# Altium project ALU_Adder_ZF.PrjPcb
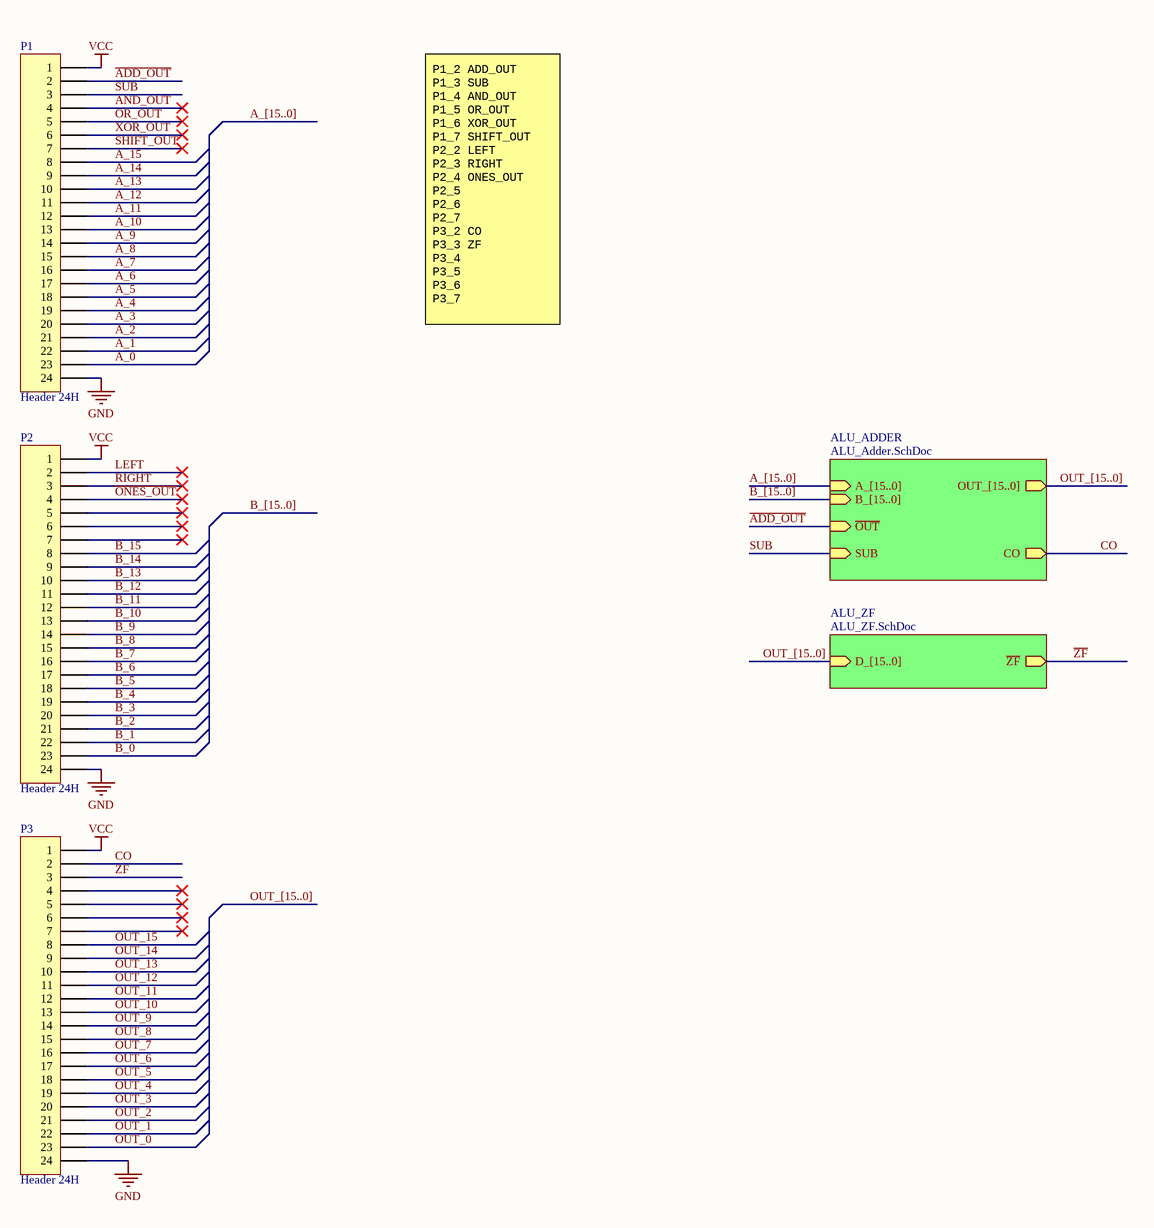
[diagram p0: Connectors.SchDoc]
3 sheets, 12 parts. Net scope: hierarchical (ports join the sheet entries above them; power ports are global).
Board file: ALU_Adder_ZF.PcbDoc
Sheets:
  Connectors.SchDoc
    ALU_ADDER = ALU_Adder.SchDoc
    ALU_ZF = ALU_ZF.SchDoc

## Sheet Connectors.SchDoc
size B; Author: E. Sims; Organization: Let's Build Rockets Inc.; SheetNumber: 1; SheetTotal: 3

### Parts
P1  Header 24H  [HDR1X24H]
P2  Header 24H  [HDR1X24H]
P3  Header 24H  [HDR1X24H]

### Sub-sheets
ALU_ADDER = ALU_Adder.SchDoc: B_[15..0] (in), ~{OUT} (in), OUT_[15..0] (out), SUB (in), A_[15..0] (in), CO (out)
ALU_ZF = ALU_ZF.SchDoc: D_[15..0] (in), ~{ZF} (out)

### Nets
GND: P1.24 P2.24 P3.24
VCC: P1.1 P2.1 P3.1
~{ADD_OUT}: P1.2 ; sheet ALU_ADDER/~{OUT}
~{AND_OUT}: P1.4
A_0: P1.23
A_1: P1.22
A_2: P1.21
A_3: P1.20
A_4: P1.19
A_5: P1.18
A_6: P1.17
A_7: P1.16
A_8: P1.15
A_9: P1.14
A_10: P1.13
A_11: P1.12
A_12: P1.11
A_13: P1.10
A_14: P1.9
A_15: P1.8
B_0: P2.23
B_1: P2.22
B_2: P2.21
B_3: P2.20
B_4: P2.19
B_5: P2.18
B_6: P2.17
B_7: P2.16
B_8: P2.15
B_9: P2.14
B_10: P2.13
B_11: P2.12
B_12: P2.11
B_13: P2.10
B_14: P2.9
B_15: P2.8
CO: P3.2 ; sheet ALU_ADDER/CO
LEFT: P2.2
~{ONES_OUT}: P2.4
~{OR_OUT}: P1.5
OUT_0: P3.23
OUT_1: P3.22
OUT_2: P3.21
OUT_3: P3.20
OUT_4: P3.19
OUT_5: P3.18
OUT_6: P3.17
OUT_7: P3.16
OUT_8: P3.15
OUT_9: P3.14
OUT_10: P3.13
OUT_11: P3.12
OUT_12: P3.11
OUT_13: P3.10
OUT_14: P3.9
OUT_15: P3.8
RIGHT: P2.3
~{SHIFT_OUT}: P1.7
SUB: P1.3 ; sheet ALU_ADDER/SUB
~{XOR_OUT}: P1.6
~{ZF}: P3.3 ; sheet ALU_ZF/~{ZF}

Not connected (* = marked no-connect by the designer): P2 5* 6* 7*; P3 4* 5* 6* 7*

### Buses and harness runs
bus A_[15..0]
bus A_[15..0] = sheet ALU_ADDER/A_[15..0]
bus B_[15..0]
bus B_[15..0] = sheet ALU_ADDER/B_[15..0]
bus OUT_[15..0]
bus OUT_[15..0] = sheet ALU_ADDER/OUT_[15..0]
bus OUT_[15..0] = sheet ALU_ZF/D_[15..0]

### Notes on the sheet
- P1_2 ADD_OUT
  P1_3 SUB
  P1_4 AND_OUT
  P1_5 OR_OUT
  P1_6 XOR_OUT
  P1_7 SHIFT_OUT
  P2_2 LEFT
  P2_3 RIGHT
  P2_4 ONES_OUT
  P2_5
  P2_6
  P2_7
  P3_2 CO
  P3_3 ZF
  P3_4
  P3_5
  P3_6
  P3_7
- Let's Build Rocket's Inc. Modular Paylaod System Based on TMP-010 Rev
  For more information visit https://github.com/LetsBuildRockets/Modular-Payload-System
  This work is licensed under CC BY-NC 4.0. To view a copy of this license, visit https://creativecommons.org/licenses/by-nc/4.0
- Title
- Size:
- Date:
- Assembly Variant:
- B
- Number:
- Time:
- Revision:
- Sheet
- of
- Author:
- File:

### Library data of the parts
P1-P3 = Header 24H: Header, 24-Pin, Right Angle; LatestRevisionDate: 17-Jul-2002; LatestRevisionNote: Re-released for DXP Platform.; Publisher: Altium Limited

## Sheet ALU_Adder.SchDoc
size B; Author: E. Sims; Organization: Let's Build Rockets Inc.; SheetNumber: 18; SheetTotal: 18
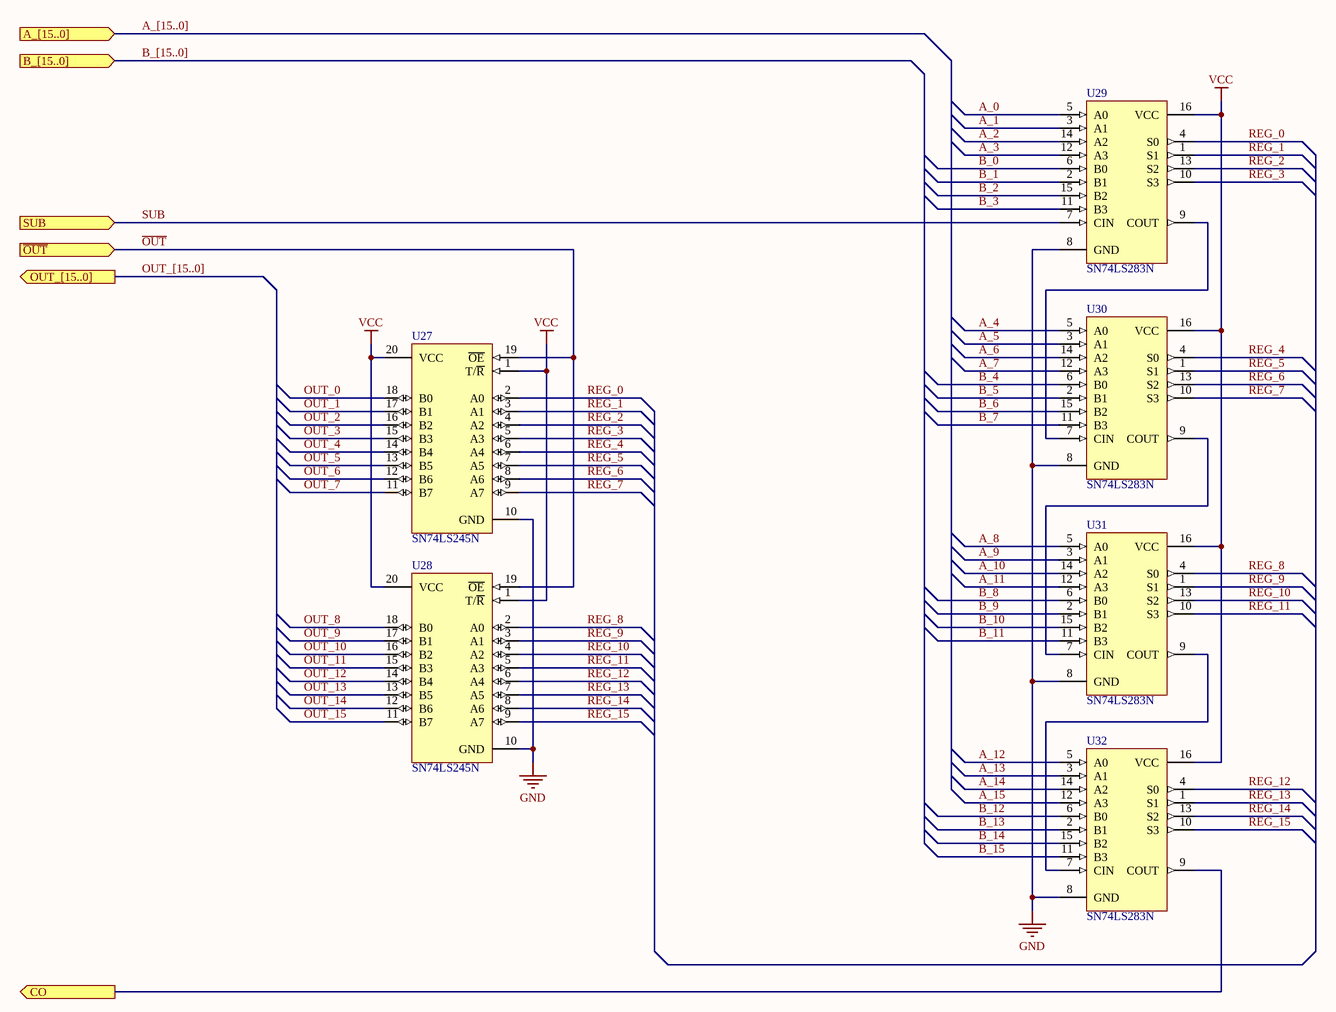
[diagram p1: ALU_Adder.SchDoc]

### Parts
U27  SN74LS245N  [N020]
U28  SN74LS245N  [N020]
U29  SN74LS283N  [W016]
U30  SN74LS283N  [W016]
U31  SN74LS283N  [W016]
U32  SN74LS283N  [W016]

### Ports
A_[15..0] (in), B_[15..0] (in), CO (out), OUT_[15..0] (out), SUB (in), ~{OUT} (in)

### Nets
GND: U27.10(GND) U28.10(GND) U29.8(GND) U30.8(GND) U31.8(GND) U32.8(GND)
VCC: U27.1(T/~{R}) U27.20(VCC) U28.1(T/~{R}) U28.20(VCC) U29.16(VCC) U30.16(VCC) U31.16(VCC) U32.16(VCC)
A_0: U29.5(A0)
A_1: U29.3(A1)
A_2: U29.14(A2)
A_3: U29.12(A3)
A_4: U30.5(A0)
A_5: U30.3(A1)
A_6: U30.14(A2)
A_7: U30.12(A3)
A_8: U31.5(A0)
A_9: U31.3(A1)
A_10: U31.14(A2)
A_11: U31.12(A3)
A_12: U32.5(A0)
A_13: U32.3(A1)
A_14: U32.14(A2)
A_15: U32.12(A3)
B_0: U29.6(B0)
B_1: U29.2(B1)
B_2: U29.15(B2)
B_3: U29.11(B3)
B_4: U30.6(B0)
B_5: U30.2(B1)
B_6: U30.15(B2)
B_7: U30.11(B3)
B_8: U31.6(B0)
B_9: U31.2(B1)
B_10: U31.15(B2)
B_11: U31.11(B3)
B_12: U32.6(B0)
B_13: U32.2(B1)
B_14: U32.15(B2)
B_15: U32.11(B3)
CO: U32.9(COUT) ; port CO
~{OUT}: U27.19(~{OE}) U28.19(~{OE}) ; port ~{OUT}  [project net ~{ADD_OUT}]
OUT_0: U27.18(B0)
OUT_1: U27.17(B1)
OUT_2: U27.16(B2)
OUT_3: U27.15(B3)
OUT_4: U27.14(B4)
OUT_5: U27.13(B5)
OUT_6: U27.12(B6)
OUT_7: U27.11(B7)
OUT_8: U28.18(B0)
OUT_9: U28.17(B1)
OUT_10: U28.16(B2)
OUT_11: U28.15(B3)
OUT_12: U28.14(B4)
OUT_13: U28.13(B5)
OUT_14: U28.12(B6)
OUT_15: U28.11(B7)
REG_0: U27.2(A0) U29.4(S0)
REG_1: U27.3(A1) U29.1(S1)
REG_2: U27.4(A2) U29.13(S2)
REG_3: U27.5(A3) U29.10(S3)
REG_4: U27.6(A4) U30.4(S0)
REG_5: U27.7(A5) U30.1(S1)
REG_6: U27.8(A6) U30.13(S2)
REG_7: U27.9(A7) U30.10(S3)
REG_8: U28.2(A0) U31.4(S0)
REG_9: U28.3(A1) U31.1(S1)
REG_10: U28.4(A2) U31.13(S2)
REG_11: U28.5(A3) U31.10(S3)
REG_12: U28.6(A4) U32.4(S0)
REG_13: U28.7(A5) U32.1(S1)
REG_14: U28.8(A6) U32.13(S2)
REG_15: U28.9(A7) U32.10(S3)
SUB: U29.7(CIN) ; port SUB
NetU29_9: U29.9(COUT) U30.7(CIN)
NetU30_9: U30.9(COUT) U31.7(CIN)
NetU31_9: U31.9(COUT) U32.7(CIN)

### Buses and harness runs
bus A_[15..0] = port A_[15..0]
bus B_[15..0] = port B_[15..0]
bus OUT_[15..0] = port OUT_[15..0]

### Notes on the sheet
- Let's Build Rocket's Inc. Modular Paylaod System Based on TMP-010 Rev
  For more information visit https://github.com/LetsBuildRockets/Modular-Payload-System
  This work is licensed under CC BY-NC 4.0. To view a copy of this license, visit https://creativecommons.org/licenses/by-nc/4.0
- Title
- Size:
- Date:
- Assembly Variant:
- B
- Number:
- Time:
- Revision:
- Sheet
- of
- Author:
- File:

### Library data of the parts
U27 U28 = SN74LS245N: Octal Bus Transceiver with 3-State Outputs; Published: 8-Jun-2000; LatestRevisionDate: 04-Mar-2005; LatestRevisionNote: Stylized 3D Model Added.; DatasheetVersion: Mar-1988; PackageVersion: Oct-1995; PackageReference: N020; Publisher: Altium Limited; PackageDescription: DIP; 20 Leads; Row Spacing 7.62 mm; Pitch 2.54 mm; ComponentLink1Description: Manufacturer Link; ComponentLink1URL: http://www.ti.com/; ComponentLink2Description: Datasheet; ComponentLink2URL: http://www-s.ti.com/sc/ds/sn74ls245.pdf
U29-U32 = SN74LS283N: 4-Bit Binary Full Adder with Fast Carry; Published: 8-Jun-2000; LatestRevisionDate: 04-Mar-2005; LatestRevisionNote: Stylized 3D Model Added.; DatasheetVersion: Mar-1988; PackageVersion: Jan-1995; PackageReference: W016; Publisher: Altium Limited; PackageDescription: DFP; 16 Leads; Body 10.9 x 7.2 mm (LxW max); Pitch 1.27 mm; ComponentLink1Description: Manufacturer Link; ComponentLink1URL: http://www.ti.com; ComponentLink2Description: Datasheet; ComponentLink2URL: http://www-s.ti.com/sc/ds/sn54ls283.pdf; Code_JEDEC: MO-092-AC

## Sheet ALU_ZF.SchDoc
size B; Author: E. Sims; Organization: Let's Build Rockets Inc.; SheetNumber: 16; SheetTotal: 16
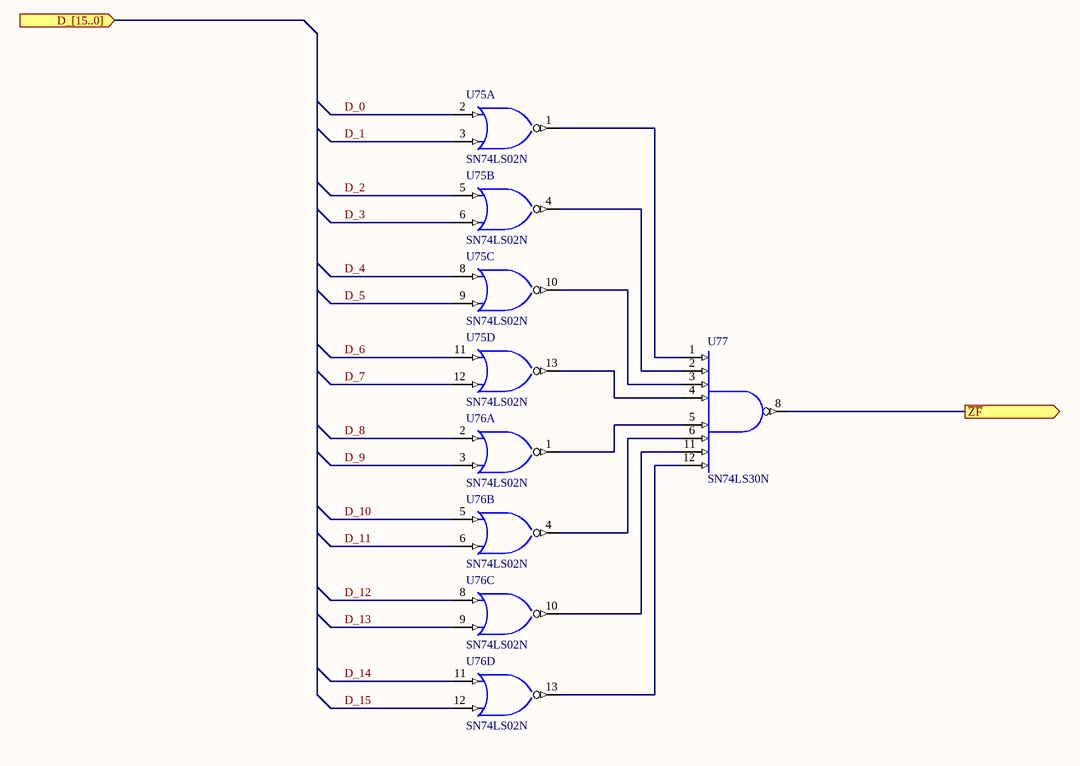
[diagram p2: ALU_ZF.SchDoc]

### Parts
U75  SN74LS02N  [N014]  (parts A,B,C,D of 4)
U76  SN74LS02N  [N014]  (parts A,B,C,D of 4)
U77  SN74LS30N  [N014]

### Ports
D_[15..0] (in), ~{ZF} (out)

### Nets
GND: U75.7(GND) U76.7(GND) U77.7(GND)
VCC: U75.14(VCC) U76.14(VCC) U77.14(VCC)
D_0: U75.2(A)
D_1: U75.3(B)
D_2: U75.5(A)
D_3: U75.6(B)
D_4: U75.8(A)
D_5: U75.9(B)
D_6: U75.11(A)
D_7: U75.12(B)
D_8: U76.2(A)
D_9: U76.3(B)
D_10: U76.5(A)
D_11: U76.6(B)
D_12: U76.8(A)
D_13: U76.9(B)
D_14: U76.11(A)
D_15: U76.12(B)
~{ZF}: U77.8(Y) ; port ~{ZF}
NetU75_1: U75.1(Y) U77.1(A)
NetU75_4: U75.4(Y) U77.2(B)
NetU75_10: U75.10(Y) U77.3(C)
NetU75_13: U75.13(Y) U77.4(D)
NetU76_1: U76.1(Y) U77.5(E)
NetU76_4: U76.4(Y) U77.6(F)
NetU76_10: U76.10(Y) U77.11(G)
NetU76_13: U76.13(Y) U77.12(H)

### Notes on the sheet
- Let's Build Rocket's Inc. Modular Paylaod System Based on TMP-010 Rev
  For more information visit https://github.com/LetsBuildRockets/Modular-Payload-System
  This work is licensed under CC BY-NC 4.0. To view a copy of this license, visit https://creativecommons.org/licenses/by-nc/4.0
- Title
- Size:
- Date:
- Assembly Variant:
- B
- Number:
- Time:
- Revision:
- Sheet
- of
- Author:
- File:

### Library data of the parts
U75 U76 = SN74LS02N: Quadruple 2-Input Positive-NOR Gate; Published: 8-Jun-2000; LatestRevisionDate: 04-Mar-2005; LatestRevisionNote: Stylized 3D Model Added.; DatasheetVersion: Mar-1988; PackageVersion: Oct-1995; PackageReference: N014; Publisher: Altium Limited; PackageDescription: DIP; 14 Leads; Row Spacing 7.62 mm; Pitch 2.54 mm; ComponentLink1Description: Manufacturer Link; ComponentLink1URL: http://www.ti.com/; ComponentLink2Description: Datasheet; ComponentLink2URL: http://www-s.ti.com/sc/ds/sn54s02.pdf
U77 = SN74LS30N: 8-Input Positive-NAND Gate; Note: Pins 9, 10  and 13 are NC & not drawn.; Published: 8-Jun-2000; LatestRevisionDate: 04-Mar-2005; LatestRevisionNote: Stylized 3D Model Added.; DatasheetVersion: Mar-1988; PackageVersion: Oct-1995; PackageReference: N014; Publisher: Altium Limited; PackageDescription: DIP; 14 Leads; Row Spacing 7.62 mm; Pitch 2.54 mm; ComponentLink1Description: Manufacturer Link; ComponentLink1URL: http://www.ti.com/; ComponentLink2Description: Datasheet; ComponentLink2URL: http://www-s.ti.com/sc/ds/sn74s30.pdf

## Nets that join several sheets
GND: Connectors (P1.24 P2.24 P3.24), ALU_Adder (6 pins), ALU_ZF (U75.7 U76.7 U77.7)
VCC: Connectors (P1.1 P2.1 P3.1), ALU_Adder (8 pins), ALU_ZF (U75.14 U76.14 U77.14)
~{ADD_OUT}: Connectors (P1.2), ALU_Adder (U27.19 U28.19)
A_0: Connectors (P1.23), ALU_Adder (U29.5)
A_1: Connectors (P1.22), ALU_Adder (U29.3)
A_2: Connectors (P1.21), ALU_Adder (U29.14)
A_3: Connectors (P1.20), ALU_Adder (U29.12)
A_4: Connectors (P1.19), ALU_Adder (U30.5)
A_5: Connectors (P1.18), ALU_Adder (U30.3)
A_6: Connectors (P1.17), ALU_Adder (U30.14)
A_7: Connectors (P1.16), ALU_Adder (U30.12)
A_8: Connectors (P1.15), ALU_Adder (U31.5)
A_9: Connectors (P1.14), ALU_Adder (U31.3)
A_10: Connectors (P1.13), ALU_Adder (U31.14)
A_11: Connectors (P1.12), ALU_Adder (U31.12)
A_12: Connectors (P1.11), ALU_Adder (U32.5)
A_13: Connectors (P1.10), ALU_Adder (U32.3)
A_14: Connectors (P1.9), ALU_Adder (U32.14)
A_15: Connectors (P1.8), ALU_Adder (U32.12)
B_0: Connectors (P2.23), ALU_Adder (U29.6)
B_1: Connectors (P2.22), ALU_Adder (U29.2)
B_2: Connectors (P2.21), ALU_Adder (U29.15)
B_3: Connectors (P2.20), ALU_Adder (U29.11)
B_4: Connectors (P2.19), ALU_Adder (U30.6)
B_5: Connectors (P2.18), ALU_Adder (U30.2)
B_6: Connectors (P2.17), ALU_Adder (U30.15)
B_7: Connectors (P2.16), ALU_Adder (U30.11)
B_8: Connectors (P2.15), ALU_Adder (U31.6)
B_9: Connectors (P2.14), ALU_Adder (U31.2)
B_10: Connectors (P2.13), ALU_Adder (U31.15)
B_11: Connectors (P2.12), ALU_Adder (U31.11)
B_12: Connectors (P2.11), ALU_Adder (U32.6)
B_13: Connectors (P2.10), ALU_Adder (U32.2)
B_14: Connectors (P2.9), ALU_Adder (U32.15)
B_15: Connectors (P2.8), ALU_Adder (U32.11)
CO: Connectors (P3.2), ALU_Adder (U32.9)
OUT_0: Connectors (P3.23), ALU_Adder (U27.18)
OUT_1: Connectors (P3.22), ALU_Adder (U27.17)
OUT_2: Connectors (P3.21), ALU_Adder (U27.16)
OUT_3: Connectors (P3.20), ALU_Adder (U27.15)
OUT_4: Connectors (P3.19), ALU_Adder (U27.14)
OUT_5: Connectors (P3.18), ALU_Adder (U27.13)
OUT_6: Connectors (P3.17), ALU_Adder (U27.12)
OUT_7: Connectors (P3.16), ALU_Adder (U27.11)
OUT_8: Connectors (P3.15), ALU_Adder (U28.18)
OUT_9: Connectors (P3.14), ALU_Adder (U28.17)
OUT_10: Connectors (P3.13), ALU_Adder (U28.16)
OUT_11: Connectors (P3.12), ALU_Adder (U28.15)
OUT_12: Connectors (P3.11), ALU_Adder (U28.14)
OUT_13: Connectors (P3.10), ALU_Adder (U28.13)
OUT_14: Connectors (P3.9), ALU_Adder (U28.12)
OUT_15: Connectors (P3.8), ALU_Adder (U28.11)
SUB: Connectors (P1.3), ALU_Adder (U29.7)
~{ZF}: Connectors (P3.3), ALU_ZF (U77.8)